# Altium schematic sheet Sheet3.SCHDOC
size 431 x 279 mm; SheetNumber: 0; SheetTotal: 0
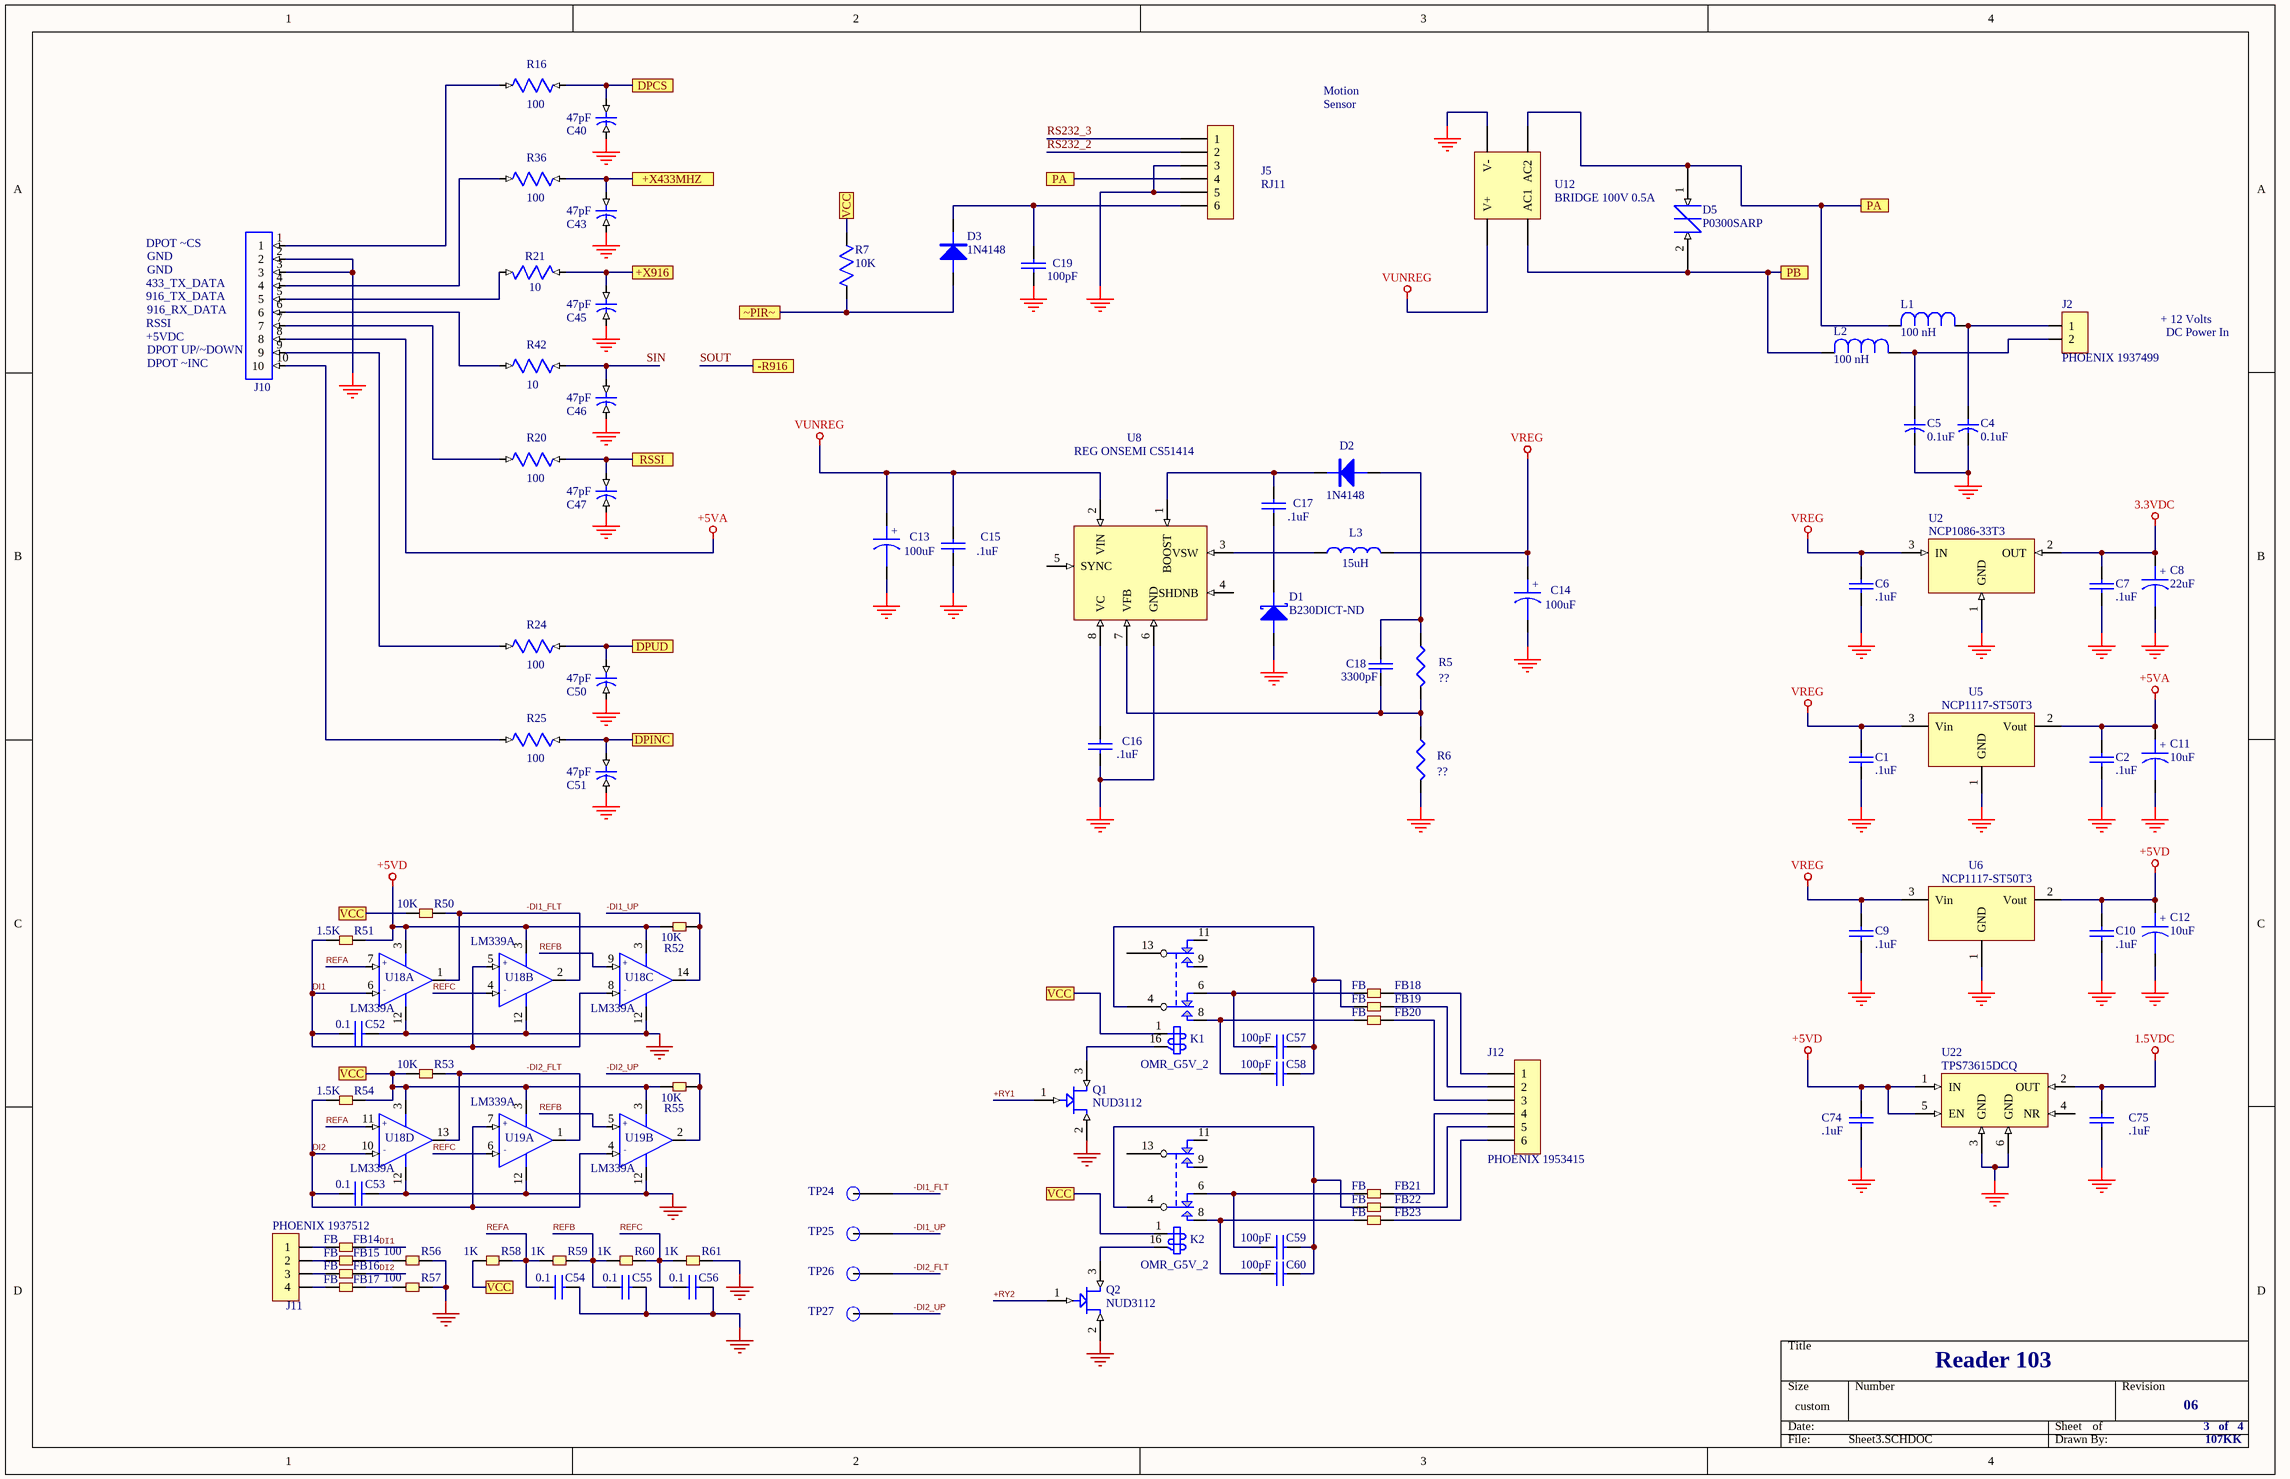
[diagram p0: Sheet3.SCHDOC]

## Parts
C1  .1uF  [0603]
C2  .1uF  [0603]
C4  0.1uF  [0603]
C5  0.1uF  [0603]
C6  .1uF  [0603]
C7  .1uF  [0603]
C8  22uF  [CAP A CASE]
C9  .1uF  [0603]
C10  .1uF  [0603]
C11  10uF  [CAP A CASE]
C12  10uF  [CAP A CASE]
C13  100uF  [CAP D CASE]
C14  100uF  [CAP D CASE]
C15  .1uF  [0603]
C16  .1uF  [0603]
C17  .1uF  [0603]
C18  3300pF  [0603]
C19  100pF  [0603]
C40  47pF  [C0603]
C43  47pF  [C0603]
C45  47pF  [C0603]
C46  47pF  [C0603]
C47  47pF  [C0603]
C50  47pF  [C0603]
C51  47pF  [C0603]
C52  0.1  [0805]
C53  0.1  [0805]
C54  0.1  [0805]
C55  0.1  [0805]
C56  0.1  [0805]
C57  100pF  [SM/C_0805]
C58  100pF  [SM/C_0805]
C59  100pF  [SM/C_0805]
C60  100pF  [SM/C_0805]
C74  .1uF  [0603]
C75  .1uF  [0603]
D1  B230DICT-ND  [DIODE SMB]
D2  1N4148  [SOD123]
D3  1N4148  [SOD123]
D5  P0300SARP  [TRANSORB_1]
FB14  FB  [0603]
FB15  FB  [0603]
FB16  FB  [0603]
FB17  FB  [0603]
FB18  FB  [SM/R_1206]
FB19  FB  [SM/R_1206]
FB20  FB  [SM/R_1206]
FB21  FB  [SM/R_1206]
FB22  FB  [SM/R_1206]
FB23  FB  [SM/R_1206]
J2  PHOENIX 1937499  [CONN PHOENIX 1803227-2]
J5  RJ11  [RJ11]
J10  1X10 HEADER  [1X10 HEADER]  (value not drawn)
J11  PHOENIX 1937512  [CONN PHOENIX 1803293-4]
J12  PHOENIX 1953415  [CONN PHOENIX 1953211-6]
K1  OMR_G5V_2  [RELAY44]
K2  OMR_G5V_2  [RELAY44]
L1  100 nH  [0603]
L2  100 nH  [0603]
L3  15uH  [COIL COILTRONICS UP2B-150]
Q1  NUD3112  [SOT23]
Q2  NUD3112  [SOT23]
R5  ??  [0603]
R6  ??  [0603]
R7  10K  [0603]
R16  100  [R0603]
R20  100  [R0603]
R21  10  [R-603]
R24  100  [R0603]
R25  100  [R0603]
R36  100  [R0603]
R42  10  [R0603]
R50  10K  [0805]
R51  1.5K  [0805]
R52  10K  [0805]
R53  10K  [0805]
R54  1.5K  [0805]
R55  10K  [0805]
R56  100  [0805]
R57  100  [0805]
R58  1K  [0805]
R59  1K  [0805]
R60  1K  [0805]
R61  1K  [0805]
TP24  TP  [TESTPOINT-1]  (value not drawn)
TP25  TP  [TESTPOINT-1]  (value not drawn)
TP26  TP  [TESTPOINT-1]  (value not drawn)
TP27  TP  [TESTPOINT-1]  (value not drawn)
U2  NCP1086-33T3  [SOT223 REG GOI]
U5  NCP1117-ST50T3  [SOT223 REG]
U6  NCP1117-ST50T3  [SOT223 REG]
U8  REG ONSEMI CS51414  [SO8]
U12  BRIDGE 100V 0.5A  [BRIDGE]
U18  LM339A  [SO14]  (parts A,B,C,D of 4)
U19  LM339A  [SO14]  (parts A,B of 4)
U22  TPS73615DCQ  [SOT223-5]

## Ports
+X433MHZ, +X916, -R916, DPCS, DPINC, DPUD, PA, PB, RSSI, VCC, ~PIR~

## Nets
1.5VDC: C75.1 U22.2(OUT)
3.3VDC: C7.1 C8.1 U2.2(OUT)
+5VA: C2.1 C11.1 J10.8 U5.2(Vout)
+5VD: C10.1 C12.1 C74.1 R51.1 R52.2 U6.2(Vout) U18.3(V+) U22.1(IN) U22.5(EN)
GND_COM: C1.2 C2.2 C4.2(B) C5.2(B) C6.2 C7.2 C8.2 C9.2 C10.2 C11.2 C12.2 C13.2 C14.2 C15.2 C16.2 C19.2 C40.2(B) C43.2(B) C45.2(B) C46.2(B) C47.2(B) C50.2(B) C51.2(B) C52.2 C53.2 C54.2 C55.2 C56.2 C74.2 C75.2 D1.A J5.3 J5.5 J10.2 J10.3 Q1.2(S) Q2.2(S) R6.2 R56.1 R57.1 R61.1 U2.1(GND) U5.1(GND) U6.1(GND) U8.6(GND) U12.V- U18.12(V-) U19.12(V-) U22.3(GND) U22.6(GND)
VREG: C1.1 C6.1 C9.1 C14.1 L3.2 U2.3(IN) U5.3(Vin) U6.3(Vin)
VUNREG: C13.1 C15.1 U8.2(VIN) U12.V+
+RY1: Q1.1(G)
+RY2: Q2.1(G)
+X433MHZ: C43.1(A) R36.2(B) ; port +X433MHZ
+X916: C45.1(A) R21.1(A) ; port +X916
-DI1_FLT: R50.1 TP24.1(TP) U18.1(OUT) U18.2(OUT)
-DI1_UP: R52.1 TP25.1(TP) U18.14(OUT)
-DI2_FLT: R53.1 TP26.1(TP) U18.13(OUT) U19.1(OUT)
-DI2_UP: R55.1 TP27.1(TP) U19.2(OUT)
DI1: C52.1 FB14.1 R51.2 U18.5(+) U18.6(-) U18.8(-)
DI2: C53.1 FB16.1 R54.2 U18.10(-) U19.4(-) U19.7(+)
DPCS: C40.1(A) R16.2(B) ; port DPCS
DPINC: C51.1(A) R25.2(B) ; port DPINC
DPUD: C50.1(A) R24.2(B) ; port DPUD
PA: D5.1 J5.4 L1.1(B) U12.AC2 ; port PA
PB: D5.2 L2.1(B) U12.AC1 ; port PB
REFA: C54.1 R58.1 R59.2 U18.7(+) U18.11(+)
REFB: C55.1 R59.1 R60.2 U18.9(+) U19.5(+)
REFC: C56.1 R60.1 R61.2 U18.4(-) U19.6(-)
RS232_2: J5.2
RS232_3: J5.1
RSSI: C47.1(A) R20.2(B) ; port RSSI
SIN: C46.1(A) R42.2(B)
SOUT: port -R916
VCC: K1.1(COIL1) K2.1(COIL1) R7.1(A) R50.2 R53.2 R54.1 R55.2 R58.2 U18.3(V+) U19.3(V+) ; port VCC
~PIR~: D3.A R7.2(B) ; port ~PIR~
NetC4_1: C4.1(A) J2.1 L1.2(A)
NetC5_1: C5.1(A) J2.2 L2.2(A)
NetC16_1: C16.1 U8.8(VC)
NetC17_1: C17.1 D2.K U8.1(BOOST)
NetC17_2: C17.2 D1.K
NetC18_1: C18.1 D2.A R5.1
NetC18_2: C18.2 R5.2 R6.1 U8.7(VFB)
NetC19_1: C19.1 D3.K J5.6
NetC57_1: C57.1 FB18.2 K1.6(NC2)
NetC57_2: C57.2 C58.2 FB19.2 K1.4(COMMON2)
NetC58_1: C58.1 FB20.2 K1.8(NO2)
NetC59_1: C59.1 FB21.2 K2.6(NC2)
NetC59_2: C59.2 C60.2 FB22.2 K2.4(COMMON2)
NetC60_1: C60.1 FB23.2 K2.8(NO2)
NetFB14_2: FB14.2 J11.1
NetFB15_1: FB15.1 R56.2
NetFB15_2: FB15.2 J11.2
NetFB16_2: FB16.2 J11.3
NetFB17_1: FB17.1 R57.2
NetFB17_2: FB17.2 J11.4
NetFB18_1: FB18.1 J12.1
NetFB19_1: FB19.1 J12.2
NetFB20_1: FB20.1 J12.3
NetFB21_1: FB21.1 J12.4
NetFB22_1: FB22.1 J12.5
NetFB23_1: FB23.1 J12.6
NetJ10_1: J10.1 R16.1(A)
NetJ10_4: J10.4 R36.1(A)
NetJ10_5: J10.5 R21.2(B)
NetJ10_6: J10.6 R42.1(A)
NetJ10_7: J10.7 R20.1(A)
NetJ10_9: J10.9 R24.1(A)
NetJ10_10: J10.10 R25.1(A)
NetK1_16: K1.16(COIL2) Q1.3(D)
NetK2_16: K2.16(COIL2) Q2.3(D)
NetL3_1: L3.1 U8.3(VSW)

Not connected (* = marked no-connect by the designer): K1 9(NO1) 11(NC1) 13(COMMON1); K2 9(NO1) 11(NC1) 13(COMMON1); U8 4(SHDNB) 5(SYNC); U22 4(NR)

## Notes on the sheet
- Motion
- Sensor
- DPOT ~CS
- 916_TX_DATA
- 433_TX_DATA
- GND
- +5VDC
- RSSI
- DPOT ~INC
- (near J10) DPOT UP/~DOWN
- 916_RX_DATA
- + 12 Volts
- DC Power In
- Reader 103
- 06
- 3   of   4
- 107KK
- (in symbol CAPACITOR POL) +

## Library data of the parts
C1 C2 C6 C7 C9 C10 C15-C19 C74 C75 = CAP: Capacitor
C4 C5 = C_0603: Part Field 1: Description CAP .10UF 25V CERAMIC Y5V 0603; Part Field 2: Vendor Kemet; Part Field 3: Part Number C0603C104Z3VACTU
C8 C11-C14 = CAPACITOR POL: Capacitor
C40 C43 C45-C47 C50 C51 = C0603: Part Field 1: Part Number 0603N470J500NT; Part Field 2: Vendor BC Components; Part Field 3: Description Cap, Ceramic, 47pF, 50V, NP0, 0603, SMD
C52-C60 = CAP NP_1: Text Field1: 20; Text Field2: 10
D1 = DIODE SCHOTTKY: Schottky Diode
D2 D3 = DIODE
D5 = TRANSORB
FB14-FB23 = FB: Text Field1: 10; Text Field2: 20
J2 = CON2: Connector
J5 J12 = CON6: Connector
J10 = HDR10
J11 = CON4: Text Field1: 20; Text Field2: 50
K1 K2 = OMRON_G5V_3: Text Field1: 20; Text Field2: 100
L1 L2 = INDUCTOR_1: Part Field 1: Part Number ELJ-RER10JF3; Part Field 2: Vendor Panasonic - ECG; Part Field 3: Description INDUCTOR 100NH 5% FIXED SMD
L3 = INDUCTOR1
Q1 Q2 = INDUCTIVE LOAD DRIVER
R5 R6 = RES1
R7 = R_0603: Part Field 1: Part Number ERA-V15J103V; Part Field 2: Vendor Panasonic - ECG; Part Field 3: Description RES 10K OHM 1/16W 1500PPM 5%0603
R16 R20 R24 R25 R36 R42 = R0603: Part Field 1: Part Number 9C06031A1000JLHFT; Part Field 2: Vendor Yageo America; Part Field 3: Description RES, 100 OHM, 1/10W, 5%, 0603, SMD
R21 = R_603: Part Field 1: Part Number 9C06031A10R0FKHFT; Part Field 2: Vendor Yageo America; Part Field 3: Description RES, 10, OHM, 1/16W, 5%, 0603, SMD
R50-R61 = RS: Text Field1: 10; Text Field2: 20
TP24-TP27 = TESTPOINT_1
U2 = REG GOI
U5 U6 = REG REVERSED
U12 = BRIDGE2: Diode Bridge
U18 U19 = LM339: Text Field1: 40; Text Field2: 40
U22 = REG SOT223-5